# EAGLE design micro-board (EAGLE 9.6.2)
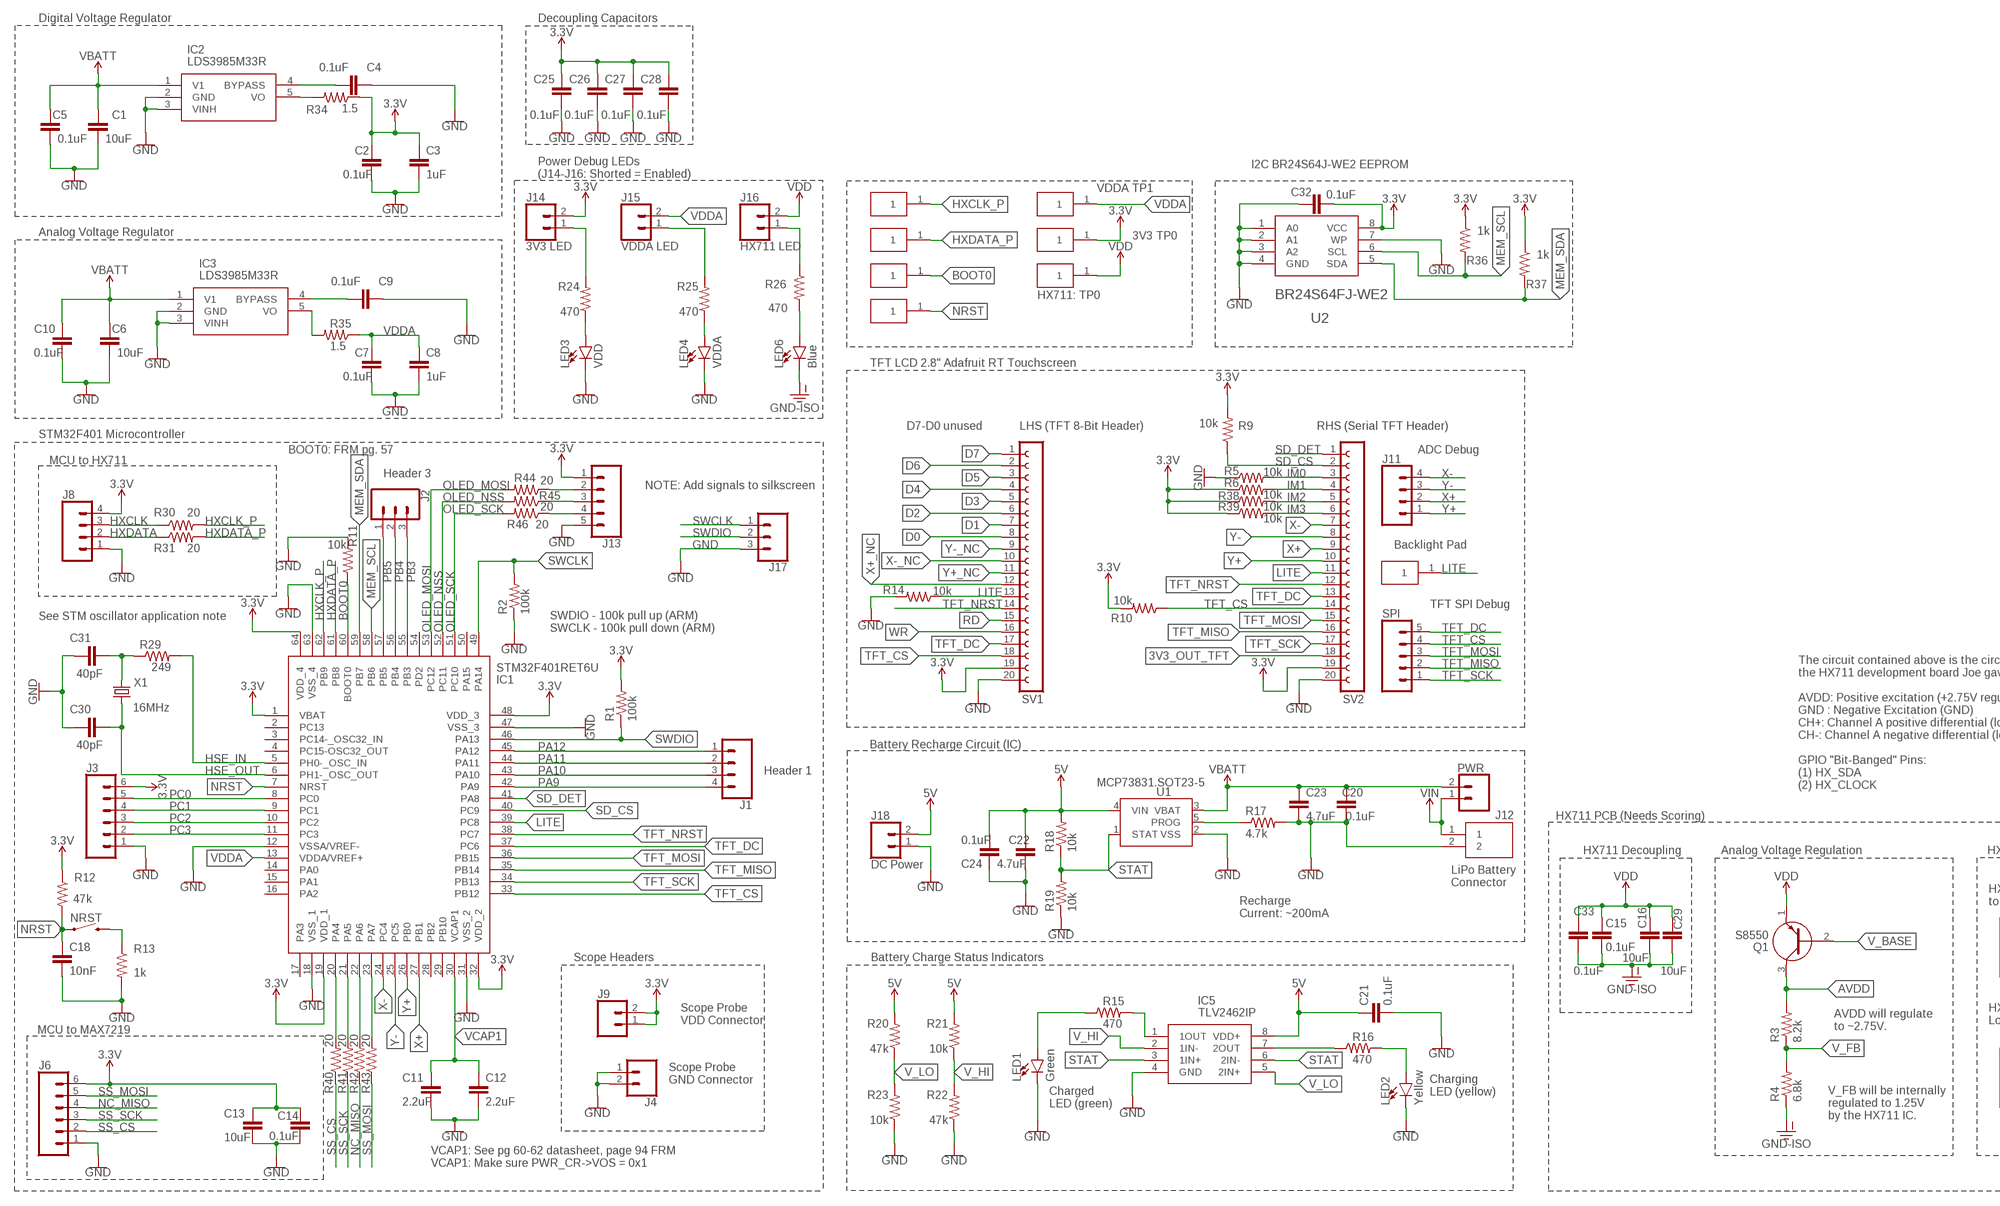
[diagram p0: schematic, sheet 1, part 1 of 2]
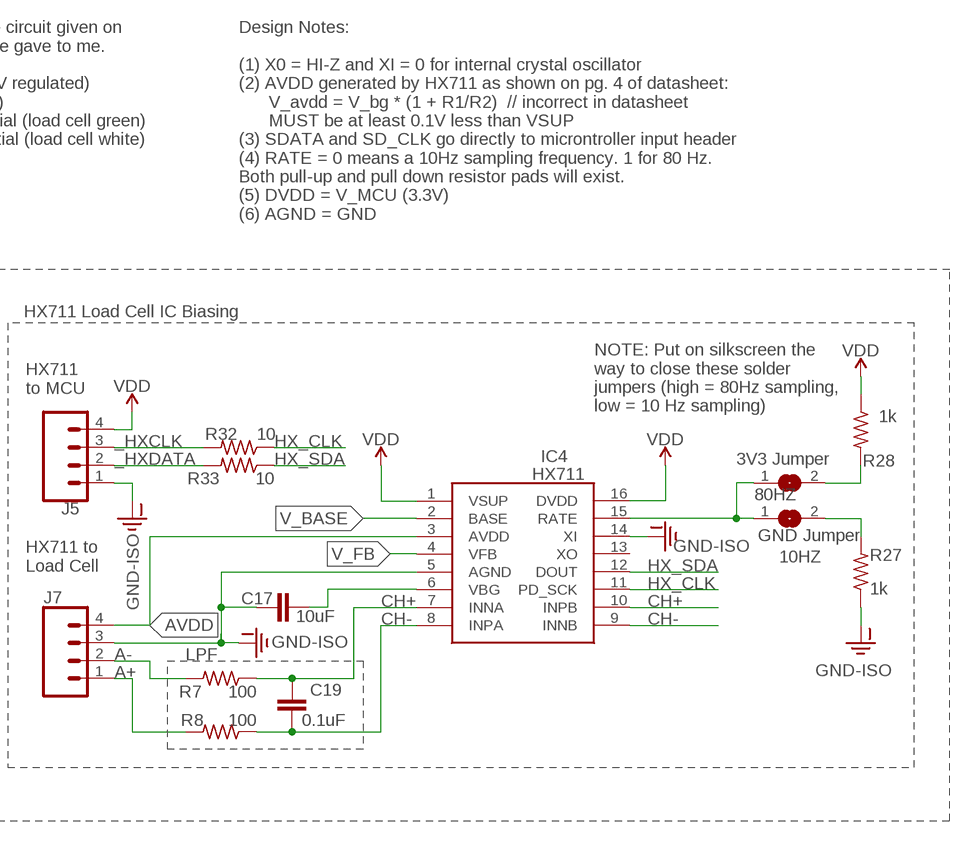
[diagram p1: schematic, sheet 1, part 2 of 2]

## Parts
10HZ  GND Jumper  SJ  [SJ]
80HZ  3V3 Jumper  SJ  [SJ]
C1  10uF  CAPACITOR0603  [C0603]
C2  0.1uF  CAPACITOR0603  [C0603]
C3  1uF  CAPACITOR0603  [C0603]
C4  0.1uF  CAPACITOR0603  [C0603]
C5  0.1uF  CAPACITOR0603  [C0603]
C6  10uF  CAPACITOR0603  [C0603]
C7  0.1uF  CAPACITOR0603  [C0603]
C8  1uF  CAPACITOR0603  [C0603]
C9  0.1uF  CAPACITOR0603  [C0603]
C10  0.1uF  CAPACITOR0603  [C0603]
C11  2.2uF  CAPACITOR0603  [C0603]
C12  2.2uF  CAPACITOR0603  [C0603]
C13  10uF  CAPACITOR0603  [C0603]
C14  0.1uF  CAPACITOR0603  [C0603]
C15  0.1uF  CAPACITOR0603  [C0603]
C16  10uF  CAPACITOR0603  [C0603]
C17  10uF  CAPACITOR0603  [C0603]
C18  10nF  CAPACITOR0603  [C0603]
C19  0.1uF  CAPACITOR0603  [C0603]
C20  0.1uF  CAPACITOR0603  [C0603]
C21  0.1uF  CAPACITOR0603  [C0603]
C22  4.7uF  C5/4.5  [C5B4.5]
C23  4.7uF  C5/4.5  [C5B4.5]
C24  0.1uF  CAPACITOR0603  [C0603]
C25  0.1uF  CAPACITOR0603  [C0603]
C26  0.1uF  CAPACITOR0603  [C0603]
C27  0.1uF  CAPACITOR0603  [C0603]
C28  0.1uF  CAPACITOR0603  [C0603]
C29  10uF  CAPACITOR0603  [C0603]
C30  40pF  CAPACITOR0603  [C0603]
C31  40pF  CAPACITOR0603  [C0603]
C32  0.1uF  CAPACITOR0603  [C0603]
C33  0.1uF  CAPACITOR0603  [C0603]
IC1  STM32F401RET6U  [QFP50P1200X1200X160-64N]
IC2  LDS3985M33R  [SOT95P280X145-5N]
IC3  LDS3985M33R  [SOT95P280X145-5N]
IC4  HX711  [SOIC127P600X160-16N]
IC5  TLV2462IP  [DIP794W53P254L959H508Q8N]
J1  CONN_04  [1X04]
J2  CONN_03  [1X03]
J3  CONN_06LOCK  [1X06_LOCK]
J4  CONN_02  [1X02]
J5  CONN_04  [1X04]
J6  CONN_06SILK_FEMALE_PTH  [1X06]
J7  CONN_04  [1X04]
J8  CONN_04  [1X04]
J9  CONN_02  [1X02]
J11  CONN_04  [1X04]
J12  B2B-PH-K-S_LF__SN_  [SHDR2W50P0X200_1X2_590X450X600]
J13  CONN_05  [1X05]
J14  3V3 LED  CONN_02  [1X02]
J15  VDDA LED  CONN_02  [1X02]
J16  HX711 LED  CONN_02  [1X02]
J17  CONN_03  [1X03]
J18  DC Power  CONN_02  [1X02]
LED1  Green  LED0603  [LED-0603]
LED2  Yellow  LED0603  [LED-0603]
LED3  VDD  LED0603  [LED-0603]
LED4  VDDA  LED0603  [LED-0603]
LED6  Blue  LED0603  [LED-0603]
NRST  MOMENTARY-SWITCH-SPST-SMD-5.2-REDUNDANT  [TACTILE_SWITCH_SMD_5.2MM]
PWR  CONN_02  [1X02]
Q1  S8550  [MJE13001TP]
R1  100k  RESISTOR0603  [R0603]
R2  100k  RESISTOR0603  [R0603]
R3  8.2k  RESISTOR0603  [R0603]
R4  6.8k  RESISTOR0603  [R0603]
R5  10k  RESISTOR0603  [R0603]
R6  10k  RESISTOR0603  [R0603]
R7  100  RESISTOR0603  [R0603]
R8  100  RESISTOR0603  [R0603]
R9  10k  RESISTOR0603  [R0603]
R10  10k  RESISTOR0603  [R0603]
R11  10k  RESISTOR0603  [R0603]
R12  47k  RESISTOR0603  [R0603]
R13  1k  RESISTOR0603  [R0603]
R14  10k  RESISTOR0603  [R0603]
R15  470  RESISTOR0603  [R0603]
R16  470  RESISTOR0603  [R0603]
R17  4.7k  RESISTOR0603  [R0603]
R18  10k  RESISTOR0603  [R0603]
R19  10k  RESISTOR0603  [R0603]
R20  47k  RESISTOR0603  [R0603]
R21  10k  RESISTOR0603  [R0603]
R22  47k  RESISTOR0603  [R0603]
R23  10k  RESISTOR0603  [R0603]
R24  470  RESISTOR0603  [R0603]
R25  470  RESISTOR0603  [R0603]
R26  470  RESISTOR0603  [R0603]
R27  1k  RESISTOR0603  [R0603]
R28  1k  RESISTOR0603  [R0603]
R29  249  RESISTOR0603  [R0603]
R30  20  RESISTOR0603  [R0603]
R31  20  RESISTOR0603  [R0603]
R32  10  RESISTOR0603  [R0603]
R33  10  RESISTOR0603  [R0603]
R34  1.5  RESISTOR0603  [R0603]
R35  1.5  RESISTOR0603  [R0603]
R36  1k  RESISTOR0603  [R0603]
R37  1k  RESISTOR0603  [R0603]
R38  10k  RESISTOR0603  [R0603]
R39  10k  RESISTOR0603  [R0603]
R40  20  RESISTOR0603  [R0603]
R41  20  RESISTOR0603  [R0603]
R42  20  RESISTOR0603  [R0603]
R43  20  RESISTOR0603  [R0603]
R44  20  RESISTOR0603  [R0603]
R45  20  RESISTOR0603  [R0603]
R46  20  RESISTOR0603  [R0603]
SPI  CONN_05  [1X05]
SV1  LHS (TFT 8-Bit Header)  FE20-1  [FE20]
SV2  RHS (Serial TFT Header)  FE20-1  [FE20]
U1  MCP73831.SOT23-5  [SOT23-5]
U2  BR24S64FJ-WE2  [SOIC8]
U$1  TP1  PAD  [PAD]
U$2  TP3  PAD  [PAD]
U$3  TP4  PAD  [PAD]
U$4  TP5  PAD  [PAD]
U$5  TP6  PAD  [PAD]
U$6  TP1  PAD  [PAD]
U$7  TP0  PAD  [PAD]
U$8  TP2  PAD  [PAD]
X1  16MHz  CRYSTALHC49S  [HC49/S]

## Nets
3.3V: C2.1 C3.1 C13.1 C14.1 C25.1 C26.1 C27.1 C28.1 C32.2 IC1.1(VBAT) IC1.19(VDD_1) IC1.32(VDD_2) IC1.48(VDD_3) IC1.64(VDD_4) J3.6 J6.6 J8.4 J9.1 J9.2 J13.1 J14.2 R1.2 R6.1 R9.2 R10.2 R12.1 R34.1 R36.1 R37.1 R38.1 R39.1 SV1.19 SV2.19 U2.8(VCC) U$7.1
3V3_LED: J14.1 R24.2
3V3_OUT_TFT: SV2.18
5V: C21.1 C22.1 C24.2 IC5.8(VDD+) J18.2 R18.2 R20.2 R21.2 U1.4(VIN)
_HXCLK: J5.3 R32.2
_HXDATA: J5.2 R33.2
_NC_MISO: IC1.22(PA6) R42.2
_SS_CS: IC1.20(PA4) R40.2
_SS_MOSI: IC1.23(PA7) R43.2
_SS_SCK: IC1.21(PA5) R41.2
A+: J7.1 R8.2
A-: J7.2 R7.2
ANA_LED: J15.1 R25.2
AVDD: IC4.3(AVDD) J7.4 Q1.3(C) R3.2
BOOT0: IC1.60(BOOT0) R11.1 U$4.1
CH+: C19.1 IC4.7(INNA) IC4.10(INPB) R7.1
CH-: C19.2 IC4.8(INPA) IC4.9(INNB) R8.1
D0: SV1.8
D1: SV1.7
D2: SV1.6
D3: SV1.5
D4: SV1.4
D5: SV1.3
D6: SV1.2
D7: SV1.1
GND: C1.2 C2.2 C3.2 C4.1 C5.2 C6.2 C7.2 C8.2 C9.1 C10.2 C11.2 C12.2 C13.2 C14.2 C18.2 C20.2 C21.2 C22.2 C23.2 C24.1 C25.2 C26.2 C27.2 C28.2 C30.1 C31.1 C32.1 IC1.12(VSSA/VREF-) IC1.18(VSS_1) IC1.31(VSS_2) IC1.47(VSS_3) IC1.63(VSS_4) IC2.2(GND) IC2.3(VINH) IC3.2(GND) IC3.3(VINH) IC5.4(GND) J3.1 J4.1 J4.2 J6.1 J8.1 J12.2 J13.5 J17.3 J18.1 LED1.C LED2.C LED3.C LED4.C R2.1 R5.1 R11.2 R13.2 R14.2 R17.2 R19.1 R22.1 R23.1 SV1.20 SV2.20 U1.2(VSS) U2.1(A0) U2.2(A1) U2.3(A2) U2.4(GND) U2.7(WP)
GND-ISO: C15.2 C16.2 C17.1 C29.2 C33.2 IC4.5(AGND) IC4.14(XI) J5.1 J7.3 LED6.C R4.1 R27.1
HSE_IN: IC1.5(PH0-_OSC_IN) R29.2
HSE_OUT: C30.2 IC1.6(PH1-_OSC_OUT) X1.1
HX_CLK: IC4.11(PD_SCK) R32.1
HX_LED: J16.1 R26.1
HX_SDA: IC4.12(DOUT) R33.1
HXCLK: J8.3 R30.1
HXCLK_P: IC1.62(PB9) R30.2 U$2.1
HXDATA: J8.2 R31.1
HXDATA_P: IC1.61(PB8) R31.2 U$3.1
IM0: R5.2 SV2.3
IM1: R6.2 SV2.4
IM2: R38.2 SV2.5
IM3: R39.2 SV2.6
LITE: IC1.39(PC8) R14.1 SV1.13 SV2.11 U$1.1
MEM_SCL: IC1.58(PB6) R36.2 U2.6(SCL)
MEM_SDA: IC1.59(PB7) R37.2 U2.5(SDA)
N$1: C9.2 IC3.4(BYPASS)
N$2: LED1.A R15.1
N$3: C4.2 IC2.4(BYPASS)
N$4: IC5.7(2OUT) R16.1
N$5: LED2.A R16.2
N$6: IC5.1(1OUT) R15.2
N$7: R17.1 U1.5(PROG)
N$8: J13.2 R44.1
N$9: LED4.A R25.1
N$10: 10HZ.2 R27.2
N$11: C17.2 IC4.6(VBG)
N$12: 10HZ.1 80HZ.1 IC4.15(RATE)
N$13: LED3.A R24.1
N$14: LED6.A R26.2
N$15: IC3.5(VO) R35.2
N$16: 80HZ.2 R28.2
N$17: NRST.3 NRST.4 R13.1
N$18: C31.2 R29.1 X1.2
N$19: IC2.5(VO) R34.2
N$20: J13.3 R45.1
N$21: J13.4 R46.1
NC_MISO: J6.4 R42.1
NRST: C18.1 IC1.7(NRST) NRST.1 NRST.2 R12.2 U$5.1
OLED_MOSI: IC1.53(PC12) R44.2
OLED_NSS: IC1.52(PC11) R45.2
OLED_SCK: IC1.51(PC10) R46.2
PA9: IC1.42(PA9) J1.4
PA10: IC1.43(PA10) J1.3
PA11: IC1.44(PA11) J1.2
PA12: IC1.45(PA12) J1.1
PB3: IC1.55(PB3) J2.3
PB4: IC1.56(PB4) J2.2
PB5: IC1.57(PB5) J2.1
PC0: IC1.8(PC0) J3.5
PC1: IC1.9(PC1) J3.4
PC2: IC1.10(PC2) J3.3
PC3: IC1.11(PC3) J3.2
RD: SV1.15
SD_CS: IC1.40(PC9) R9.1 SV2.2
SD_DET: IC1.41(PA8) SV2.1
SS_CS: J6.2 R40.1
SS_MOSI: J6.5 R43.1
SS_SCK: J6.3 R41.1
STAT: IC5.3(1IN+) IC5.6(2IN-) R18.1 R19.2 U1.1(STAT)
SWCLK: IC1.49(PA14) J17.1 R2.2
SWDIO: IC1.46(PA13) J17.2 R1.1
TFT_CS: IC1.33(PB12) R10.1 SPI.4 SV1.18 SV2.14
TFT_DC: IC1.37(PC6) SPI.5 SV1.17 SV2.13
TFT_MISO: IC1.35(PB14) SPI.2 SV2.16
TFT_MOSI: IC1.36(PB15) SPI.3 SV2.15
TFT_NRST: IC1.38(PC7) SV1.14 SV2.12
TFT_SCK: IC1.34(PB13) SPI.1 SV2.17
V_BASE: IC4.2(BASE) Q1.2(B)
V_BATT: C1.1 C5.1 C6.1 C10.1 C20.1 C23.1 IC2.1(V1) IC3.1(V1) PWR.2 U1.3(VBAT) ; supply symbol labelled VBATT
V_FB: IC4.4(VFB) R3.1 R4.2
V_HI: IC5.2(1IN-) R21.1 R22.2
V_LO: IC5.5(2IN+) R20.1 R23.2
VCAP1: C11.1 C12.1 IC1.30(VCAP1)
VDD: C15.1 C16.1 C29.1 C33.1 IC4.1(VSUP) IC4.16(DVDD) J5.4 J16.2 Q1.1(E) R28.1 U$8.1
VDDA: C7.1 C8.1 IC1.13(VDDA/VREF+) J15.2 R35.1 U$6.1
VIN: J12.1 PWR.1
WR: SV1.16
X+: IC1.27(PB1) J11.2 SV2.9
X+_NC: SV1.12
X-: IC1.24(PC4) J11.4 SV2.7
X-_NC: SV1.10
Y+: IC1.26(PB0) J11.1 SV2.10
Y+_NC: SV1.11
Y-: IC1.25(PC5) J11.3 SV2.8
Y-_NC: SV1.9
Unconnected: IC1.2(PC13) IC1.3(PC14-_OSC32_IN) IC1.4(PC15-OSC32_OUT) IC1.14(PA0) IC1.15(PA1) IC1.16(PA2) IC1.17(PA3) IC1.28(PB2) IC1.29(PB10) IC1.50(PA15) IC1.54(PD2) IC4.13(XO)

## Notes on the sheet
- Digital Voltage Regulator | Decoupling Capacitors
- I2C BR24S64J-WE2 EEPROM
- Power Debug LEDs
  (J14-J16: Shorted = Enabled)
- VDDA TP1
- Analog Voltage Regulator
- 3V3 TP0
- HX711: TP0
- TFT LCD 2.8" Adafruit RT Touchscreen
- D7-D0 unused
- STM32F401 Microcontroller
- BOOT0: FRM pg. 57 | ADC Debug
- MCU to HX711
- Header 3
- NOTE: Add signals to silkscreen
- Backlight Pad
- TFT SPI Debug
- See STM oscillator application note
- SWDIO - 100k pull up (ARM)
  SWCLK - 100k pull down (ARM)
- The circuit contained above is the circuit given on
  the HX711 development board Joe gave to me.
  
  AVDD: Positive excitation (+2.75V regulated)
  GND : Negative Excitation (GND)
  CH+: Channel A positive differential (load cell green)
  CH-: Channel A negative differential (load cell white)
  
  GPIO "Bit-Banged" Pins:
  (1) HX_SDA
  (2) HX_CLOCK
- Design Notes:
  
  (1) X0 = HI-Z and XI = 0 for internal crystal oscillator
  (2) AVDD generated by HX711 as shown on pg. 4 of datasheet:
        V_avdd = V_bg * (1 + R1/R2)  // incorrect in datasheet
        MUST be at least 0.1V less than VSUP
  (3) SDATA and SD_CLK go directly to microntroller input header
  (4) RATE = 0 means a 10Hz sampling frequency. 1 for 80 Hz.
  Both pull-up and pull down resistor pads will exist.
  (5) DVDD = V_MCU (3.3V)
  (6) AGND = GND
- Battery Recharge Circuit (IC)
- Header 1
- HX711 PCB (Needs Scoring)
- HX711 Decoupling | Analog Voltage Regulation | HX711 Load Cell IC Biasing
- LiPo Battery
  Connector
- HX711
  to MCU
- Recharge
  Current: ~200mA
- NOTE: Put on silkscreen the
  way to close these solder
  jumpers (high = 80Hz sampling,
  low = 10 Hz sampling)
- Scope Headers | Battery Charge Status Indicators
- Scope Probe
  VDD Connector
- HX711 to
  Load Cell
- AVDD will regulate 
  to ~2.75V.
- MCU to MAX7219
- Scope Probe
  GND Connector
- LPF
- Charging
  LED (yellow)
- Charged
  LED (green)
- V_FB will be internally
  regulated to 1.25V
  by the HX711 IC.
- VCAP1: See pg 60-62 datasheet, page 94 FRM
  VCAP1: Make sure PWR_CR->VOS = 0x1

## Library data of the parts
10HZ 80HZ = jumper:SJ: SMD solder JUMPER
C1-C21 C24-C33 = LinnesLab-Passives:CAPACITOR
C22 C23 = capacitor-wima:C: CAPACITOR naming: grid - package width
IC1 = SamacSys_Parts:STM32F401RET6U: STMICROELECTRONICS - STM32F401RET6U - MCU, 32BIT, CORTEX-M4, 84MHZ, LQFP-64 Source: Datasheet; DESCRIPTION: STMICROELECTRONICS - STM32F401RET6U - MCU, 32BIT, CORTEX-M4, 84MHZ, LQFP-64; HEIGHT: 1.6mm; MANUFACTURER_NAME: STMicroelectronics; MANUFACTURER_PART_NUMBER: STM32F401RET6U; MOUSER_PART_NUMBER: 511-STM32F401RET6U; MOUSER_PRICE-STOCK: https://www.mouser.co.uk/ProductDetail/STMicroelectronics/STM32F401RET6U?qs=9MuLHSklicoIHeb2rbkFrA%3D%3D
IC2 IC3 = SamacSys_Parts:LDS3985M33R: STMicroelectronics LDS3985M33R, Single Low Dropout Voltage Regulator, 300mA 3.3 V, 5-Pin SOT-23 Source: Datasheet; ARROW_PART_NUMBER: LDS3985M33R; ARROW_PRICE-STOCK: https://www.arrow.com/en/products/lds3985m33r/stmicroelectronics?region=nac; DESCRIPTION: STMicroelectronics LDS3985M33R, Single Low Dropout Voltage Regulator, 300mA 3.3 V, 5-Pin SOT-23; HEIGHT: 1.45mm; MANUFACTURER_NAME: STMicroelectronics; MANUFACTURER_PART_NUMBER: LDS3985M33R; MOUSER_PART_NUMBER: 511-LDS3985M33R; MOUSER_PRICE-STOCK: https://www.mouser.co.uk/ProductDetail/STMicroelectronics/LDS3985M33R?qs=DcAdhm6iCnom47SfkNYeVw%3D%3D
IC4 = SamacSys_Parts:HX711: 24-Bit Analog-to-Digital Converter (ADC) for Weigh Scale Source: Datasheet; DESCRIPTION: 24-Bit Analog-to-Digital Converter (ADC) for Weigh Scale; HEIGHT: 1.6mm; MANUFACTURER_NAME: AVIA Semiconductor; MANUFACTURER_PART_NUMBER: HX711
IC5 = SamacSys_Parts:TLV2462IP: Dual Low-Power, Rail-to-Rail Input/Output Operational Amplifier Source: Datasheet; ARROW_PART_NUMBER: TLV2462IP; ARROW_PRICE-STOCK: https://www.arrow.com/en/products/tlv2462ip/texas-instruments; DESCRIPTION: Dual Low-Power, Rail-to-Rail Input/Output Operational Amplifier; HEIGHT: 5.08mm; MANUFACTURER_NAME: Texas Instruments; MANUFACTURER_PART_NUMBER: TLV2462IP; MOUSER_PART_NUMBER: 595-TLV2462IP; MOUSER_PRICE-STOCK: https://www.mouser.co.uk/ProductDetail/Texas-Instruments/TLV2462IP?qs=0le1rQK8zxo1BiHyPl8Tnw%3D%3D
J1 J5 J7 J8 J11 = LinnesLab-Connectors:CONN_04: Multi connection point. Often used as Generic Header-pin footprint for 0.1 inch spaced/style header connections On any of the 0.1 inch spaced packages, you can populate with these: Break Away Headers - Straight (PRT-00116) Break Away Male Headers - Right Angle (PRT-00553) Female Headers (PRT-00115) Break Away Headers - Machine Pin (PRT-00117) Break Away Female Headers - Swiss Machine Pin (PRT-00743) For SCREWTERMINALS and SPRING TERMINALS visit here: Screw Terimnals on SparkFun.com (5mm/3.5mm/2.54mm spacing) This device is also useful as a general connection point to wire up your design to another part of your project. Our various solder wires solder well into these plated through hole pads. Hook-Up Wire - Assortment (Stranded, 22 AWG) (PRT-11375) Hook-Up Wire - Assortment (Solid Core, 22 AWG) (PRT-11367) View the entire wire category on our website here Special notes: Molex polarized connector foot print use with SKU : PRT-08231 with associated crimp pins and housings. 1MM SMD Version SKU: PRT-10208; PROD_ID: CONN-09696
J2 J17 = LinnesLab-Connectors:CONN_03: Multi connection point. Often used as Generic Header-pin footprint for 0.1 inch spaced/style header connections On any of the 0.1 inch spaced packages, you can populate with these: Break Away Headers - Straight (PRT-00116) Break Away Male Headers - Right Angle (PRT-00553) Female Headers (PRT-00115) Break Away Headers - Machine Pin (PRT-00117) Break Away Female Headers - Swiss Machine Pin (PRT-00743) Stackable Header - 3 Pin (Female, 0.1") (PRT-13875) For SCREWTERMINALS and SPRING TERMINALS visit here: Screw Terimnals on SparkFun.com (5mm/3.5mm/2.54mm spacing) This device is also useful as a general connection point to wire up your design to another part of your project. Our various solder wires solder well into these plated through hole pads. Hook-Up Wire - Assortment (Stranded, 22 AWG) (PRT-11375) Hook-Up Wire - Assortment (Solid Core, 22 AWG) (PRT-11367) View the entire wire category on our website here Special notes: Molex polarized connector foot print use with SKU : PRT-08232 with associated crimp pins and housings.
J3 = LinnesLab-Connectors:CONN_06: Multi connection point. Often used as Generic Header-pin footprint for 0.1 inch spaced/style header connections On any of the 0.1 inch spaced packages, you can populate with these: Break Away Headers - Straight (PRT-00116) Break Away Male Headers - Right Angle (PRT-00553) Female Headers (PRT-00115) Break Away Headers - Machine Pin (PRT-00117) Break Away Female Headers - Swiss Machine Pin (PRT-00743) Arduino Stackable Header - 6 Pin (PRT-09280) For SCREWTERMINALS and SPRING TERMINALS visit here: Screw Terimnals on SparkFun.com (5mm/3.5mm/2.54mm spacing) This device is also useful as a general connection point to wire up your design to another part of your project. Our various solder wires solder well into these plated through hole pads. Hook-Up Wire - Assortment (Stranded, 22 AWG) (PRT-11375) Hook-Up Wire - Assortment (Solid Core, 22 AWG) (PRT-11367) View the entire wire category on our website here
J4 J9 J14-J16 J18 PWR = LinnesLab-Connectors:CONN_02: Multi connection point. Often used as Generic Header-pin footprint for 0.1 inch spaced/style header connections On any of the 0.1 inch spaced packages, you can populate with these: Break Away Headers - Straight (PRT-00116) Break Away Male Headers - Right Angle (PRT-00553) Female Headers (PRT-00115) Break Away Headers - Machine Pin (PRT-00117) Break Away Female Headers - Swiss Machine Pin (PRT-00743) For SCREWTERMINALS and SPRING TERMINALS visit here: Screw Terimnals on SparkFun.com (5mm/3.5mm/2.54mm spacing) This device is also useful as a general connection point to wire up your design to another part of your project. Our various solder wires solder well into these plated through hole pads. Hook-Up Wire - Assortment (Stranded, 22 AWG) (PRT-11375) Hook-Up Wire - Assortment (Solid Core, 22 AWG) (PRT-11367) View the entire wire category on our website here Special notes: Molex polarized connector foot print use with: PRT-08233 with associated crimp pins and housings. 2.54_SCREWTERM for use with PRT-10571. 3.5mm Screw Terminal footprints for PRT-08084 5mm Screw Terminal footprints for use with PRT-08432
J6 = LinnesLab-Connectors:CONN_06: Multi connection point. Often used as Generic Header-pin footprint for 0.1 inch spaced/style header connections On any of the 0.1 inch spaced packages, you can populate with these: Break Away Headers - Straight (PRT-00116) Break Away Male Headers - Right Angle (PRT-00553) Female Headers (PRT-00115) Break Away Headers - Machine Pin (PRT-00117) Break Away Female Headers - Swiss Machine Pin (PRT-00743) Arduino Stackable Header - 6 Pin (PRT-09280) For SCREWTERMINALS and SPRING TERMINALS visit here: Screw Terimnals on SparkFun.com (5mm/3.5mm/2.54mm spacing) This device is also useful as a general connection point to wire up your design to another part of your project. Our various solder wires solder well into these plated through hole pads. Hook-Up Wire - Assortment (Stranded, 22 AWG) (PRT-11375) Hook-Up Wire - Assortment (Solid Core, 22 AWG) (PRT-11367) View the entire wire category on our website here; PROD_ID: CONN-08437
J12 = SamacSys_Parts:B2B-PH-K-S_LF__SN_: Conn Shrouded Header HDR 2 POS 2mm Solder ST Thru-Hole Box Source: Datasheet; ARROW_PART_NUMBER: B2B-PH-K-S(LF)(SN); ARROW_PRICE-STOCK: https://www.arrow.com/en/products/b2b-ph-k-s-lf-sn/jst-manufacturing; DESCRIPTION: Conn Shrouded Header HDR 2 POS 2mm Solder ST Thru-Hole Box; HEIGHT: 6mm; MANUFACTURER_NAME: JST (JAPAN SOLDERLESS TERMINALS); MANUFACTURER_PART_NUMBER: B2B-PH-K-S(LF)(SN)
J13 SPI = LinnesLab-Connectors:CONN_05: Multi connection point. Often used as Generic Header-pin footprint for 0.1 inch spaced/style header connections On any of the 0.1 inch spaced packages, you can populate with these: Break Away Headers - Straight (PRT-00116) Break Away Male Headers - Right Angle (PRT-00553) Female Headers (PRT-00115) Break Away Headers - Machine Pin (PRT-00117) Break Away Female Headers - Swiss Machine Pin (PRT-00743) For SCREWTERMINALS and SPRING TERMINALS visit here: Screw Terimnals on SparkFun.com (5mm/3.5mm/2.54mm spacing) This device is also useful as a general connection point to wire up your design to another part of your project. Our various solder wires solder well into these plated through hole pads. Hook-Up Wire - Assortment (Stranded, 22 AWG) (PRT-11375) Hook-Up Wire - Assortment (Solid Core, 22 AWG) (PRT-11367) View the entire wire category on our website here Special notes: Molex polarized connector foot print use with SKU : PRT-08231 with associated crimp pins and housings. 1MM SMD Version SKU: PRT-10208
LED1-LED4 LED6 = LinnesLab-LED:LED: LED (Generic) Standard schematic elements and footprints for 5mm, 3mm, 1206, and 0603 sized LEDs. Generic LEDs with no color specified. LTST-C190KGKT: arrow indicates cathode
NRST = SparkFun-Switches:MOMENTARY-SWITCH-SPST: Momentary Switch (Pushbutton) - SPST Normally-open (NO) SPST momentary switches (buttons, pushbuttons). Variants PTH-12MM - 12mm square, through-hole Momentary Pushbutton Switch - 12mm Square (COM-09190) PTH-6.0MM, PTH-6.0MM-KIT - 6.0mm square, through-hole Mini Pushbutton Switch (COM-00097) KIT package intended for soldering kit's - only one side of pads' copper is exposed. PTH-RIGHT-ANGLE-KIT - Right-angle, through-hole Right Angle Tactile Button - Used on SparkFun BigTime Watch Kit SMD-12MM - 12mm square, surface-mount Tactile Button - SMD (12mm) (COM-12993) Used on SparkFun PicoBoard SMD-4.5MM - 4.5mm Square Trackball Switch Used on SparkFun Blackberry Trackballer Breakout SMD-4.6MMX2.8MM - 4.60mm x 2.80mm, surface mount Used on SparkFun SAMD21 Mini Breakout SMD-5.2MM, SMD-5.2-REDUNDANT - 5.2mm square, surface-mount Mini Pushbutton Switch - SMD (COM-08720) Used on Arduino Pro Mini REDUNDANT package connects both switch circuits together SMD-6.0X3.5MM - 6.0 x 3.5mm, surface mount Momentary Reset Switch SMD (COM-08229) SMD-6.2MM-TALL - 6.2mm square, surface mount Tactile Button - SMD (6mm) Used on SparkFun Digital Sandbox SMD-RIGHT-ANGLE - Right-angle, surface mount Used on SparkFun Block for Intel® Edison - Arduino; PROD_ID: SWCH-08247; SF_SKU: COM-08720
Q1 = SamacSys_Parts:S8550: PNP Silicon Transistors Source: Datasheet; DESCRIPTION: PNP Silicon Transistors; HEIGHT: mm; MANUFACTURER_NAME: MCC(Micro Commercial Components); MANUFACTURER_PART_NUMBER: S8550
R1-R46 = LinnesLab-Passives:RESISTOR
SV1 SV2 = con-lsta:FE20-1: FEMALE HEADER; OC_FARNELL: unknown; OC_NEWARK: unknown
U1 = LinnesLab-Power:MCP73831
U2 = I2C-EEPROM:BR24S64FJ-WE2: 64Kbit size EEPROM using the I2C protocol for communication
U$1-U$8 = LinnesLab-Connectors:PAD
X1 = crystal:CRYSTAL: CRYSTAL; OC_FARNELL: 1667008; OC_NEWARK: unknown

## Board
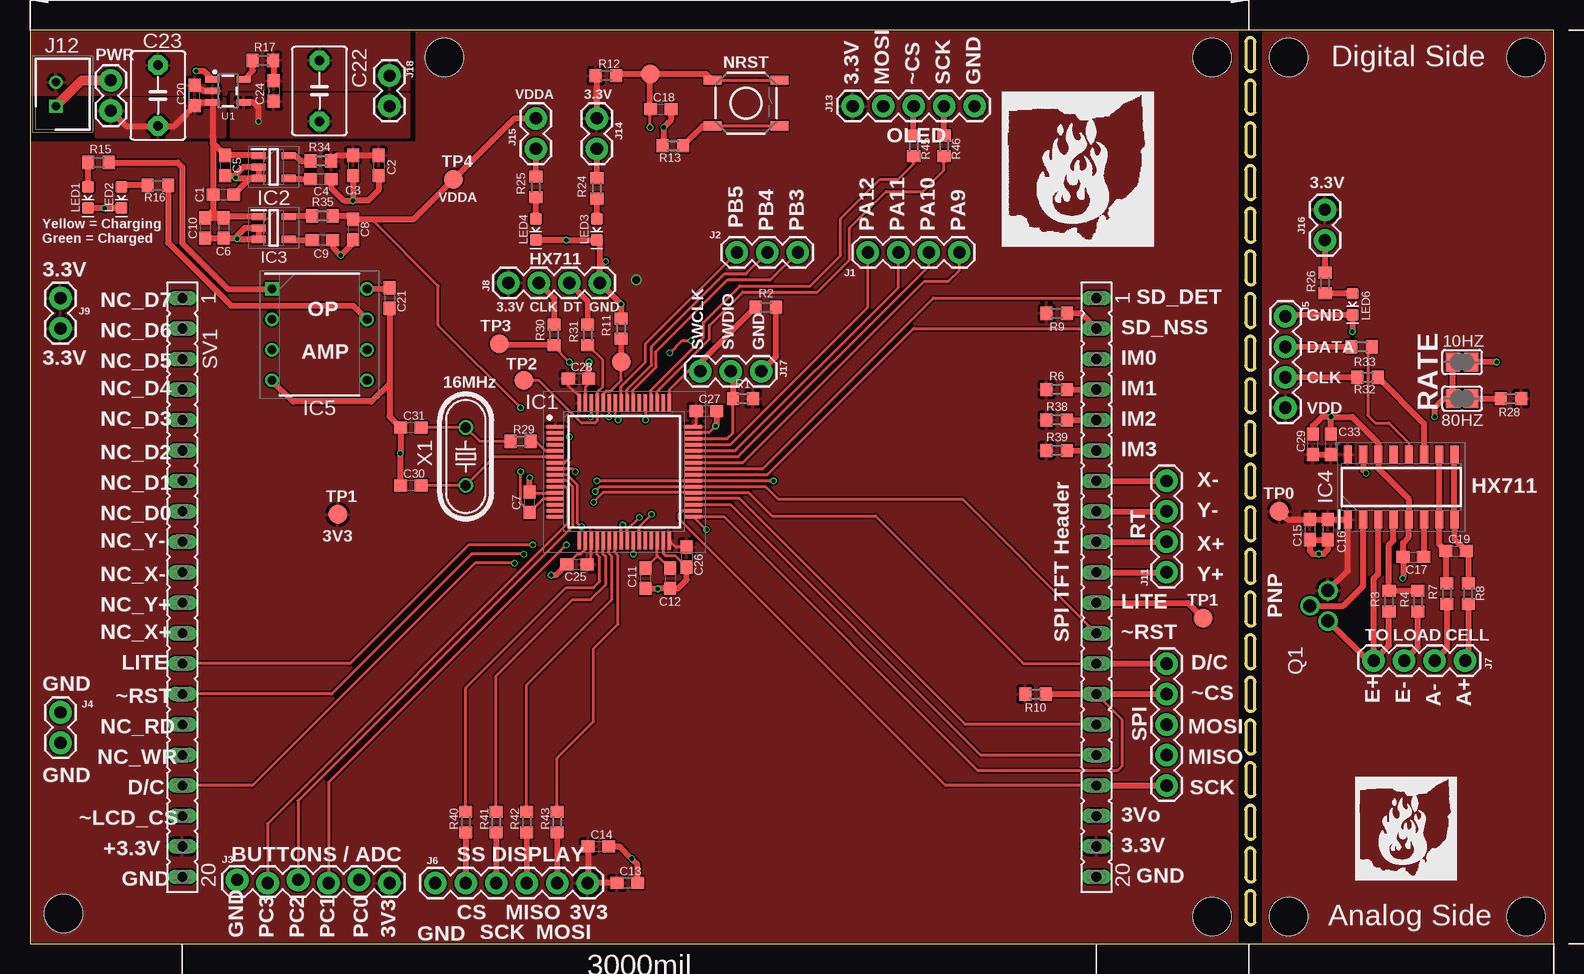
[diagram p2: board, top side]
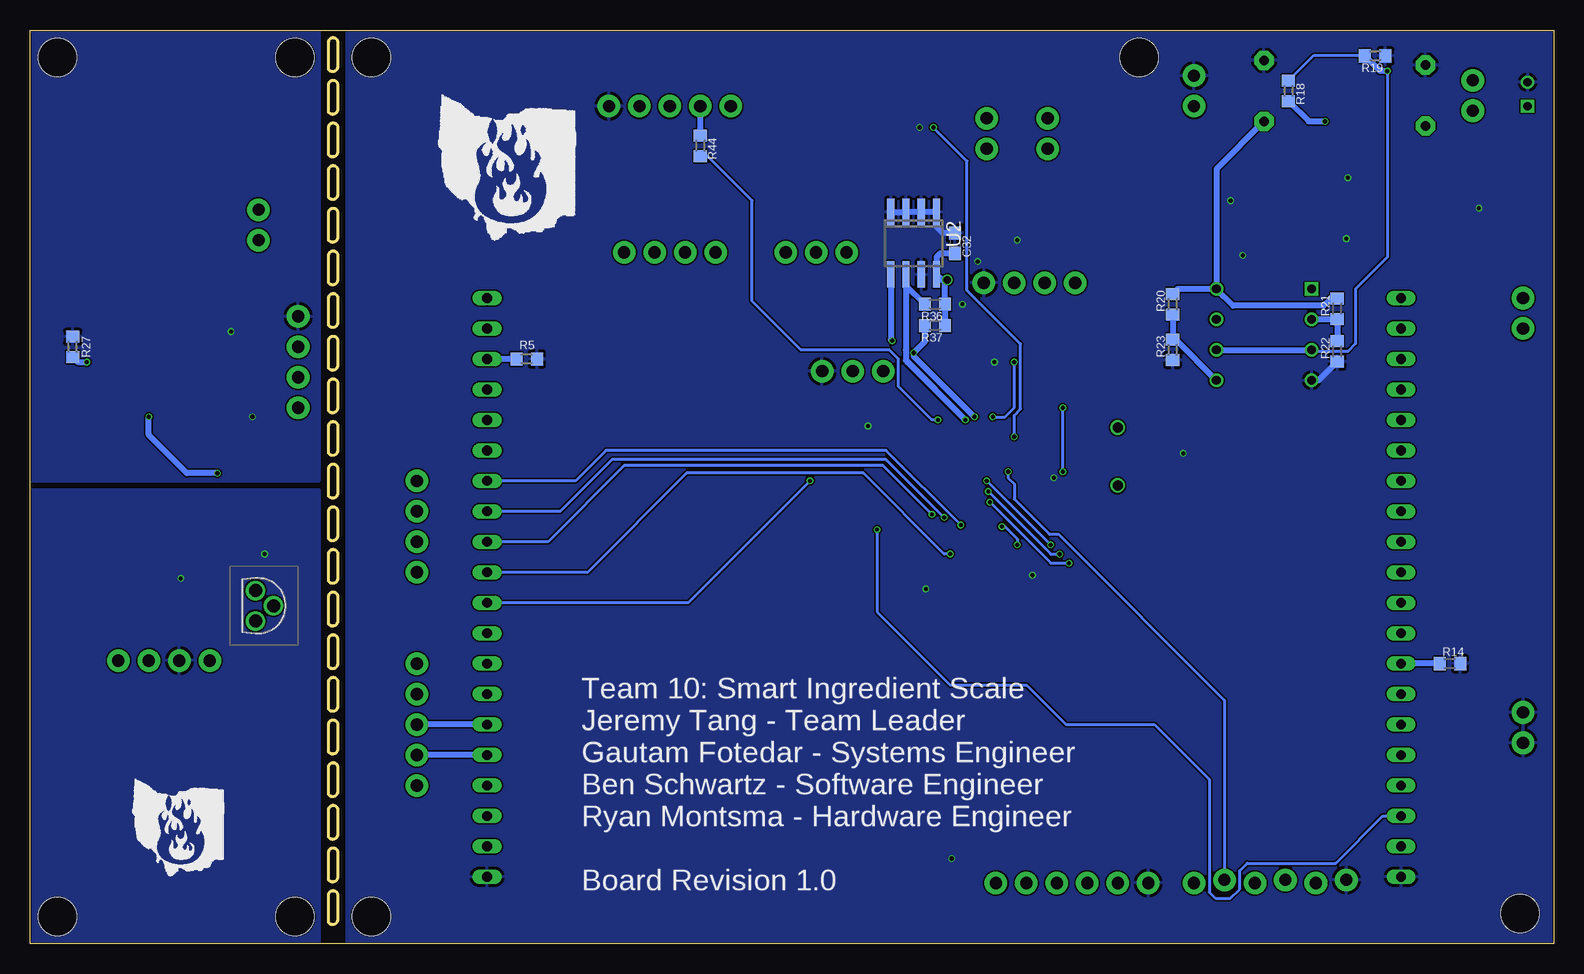
[diagram p3: board, bottom side, seen from below]

Size 127 x 76.2 mm. Coordinates in mm from the lower left corner, seen from the top.
Outline: 88 segments
Copper layers (1*16): Top 0.035mm / dielectric 0.2mm / Bottom 0.035mm
Design rules "jlcpcb *": minimum track width 8mil, minimum drill 0.2mm, track to track 5mil, track to pad 5mil, pad to pad 5mil, via to via 5mil, smd to smd 0mil, copper to edge 0.1mm, drill to drill 5mil, minimum pad ring 4mil, minimum via ring 4mil, stop-mask expansion 3mil, vias tented up to drill 100mil, thermal gap 10mil
Holes 3.2 mm at 98.55,73.91 98.55,2.29 2.79,2.54 34.54,73.91 104.9,73.91 124.71,73.91 124.71,2.29 104.9,2.29

### Footprints (pad centres in the part's own frame; a part is rotated, then mirrored left to right if it is on the bottom)
SJ = smd 1.168 x 1.6: 1 -0.762,0; 2 0.762,0
C0603 = smd 1.1 x 1: 1 -0.85,0; 2 0.85,0
C5B4.5 = drill 0.813 pad 1.6 octagon: 1 -2.54,0; 2 2.54,0
QFP50P1200X1200X160-64N = smd 1.475 x 0.3: 1 -5.738,3.75; 2 -5.738,3.25; 3 -5.738,2.75; 4 -5.738,2.25; 5 -5.738,1.75; 6 -5.738,1.25; 7 -5.738,0.75; 8 -5.738,0.25; 9 -5.738,-0.25; 10 -5.738,-0.75; 11 -5.738,-1.25; 12 -5.738,-1.75; 13 -5.738,-2.25; 14 -5.738,-2.75; 15 -5.738,-3.25; 16 -5.738,-3.75; 33 5.738,-3.75; 34 5.738,-3.25; 35 5.738,-2.75; 36 5.738,-2.25; 37 5.738,-1.75; 38 5.738,-1.25; 39 5.738,-0.75; 40 5.738,-0.25; 41 5.738,0.25; 42 5.738,0.75; 43 5.738,1.25; 44 5.738,1.75; 45 5.738,2.25; 46 5.738,2.75; 47 5.738,3.25; 48 5.738,3.75 | smd 0.3 x 1.475: 17 -3.75,-5.738; 18 -3.25,-5.738; 19 -2.75,-5.738; 20 -2.25,-5.738; 21 -1.75,-5.738; 22 -1.25,-5.738; 23 -0.75,-5.738; 24 -0.25,-5.738; 25 0.25,-5.738; 26 0.75,-5.738; 27 1.25,-5.738; 28 1.75,-5.738; 29 2.25,-5.738; 30 2.75,-5.738; 31 3.25,-5.738; 32 3.75,-5.738; 49 3.75,5.738; 50 3.25,5.738; 51 2.75,5.738; 52 2.25,5.738; 53 1.75,5.738; 54 1.25,5.738; 55 0.75,5.738; 56 0.25,5.738; 57 -0.25,5.738; 58 -0.75,5.738; 59 -1.25,5.738; 60 -1.75,5.738; 61 -2.25,5.738; 62 -2.75,5.738; 63 -3.25,5.738; 64 -3.75,5.738
SOT95P280X145-5N = smd 1.15 x 0.6: 1 -1.25,0.95; 2 -1.25,0; 3 -1.25,-0.95; 4 1.25,-0.95; 5 1.25,0.95
SOIC127P600X160-16N = smd 1.525 x 0.7: 1 -2.712,4.445; 2 -2.712,3.175; 3 -2.712,1.905; 4 -2.712,0.635; 5 -2.712,-0.635; 6 -2.712,-1.905; 7 -2.712,-3.175; 8 -2.712,-4.445; 9 2.712,-4.445; 10 2.712,-3.175; 11 2.712,-1.905; 12 2.712,-0.635; 13 2.712,0.635; 14 2.712,1.905; 15 2.712,3.175; 16 2.712,4.445
DIP794W53P254L959H508Q8N = drill 0.73 pad 1.13 square: 1 -3.97,3.81 | drill 0.73 pad 1.13: 2 -3.97,1.27; 3 -3.97,-1.27; 4 -3.97,-3.81; 5 3.97,-3.81; 6 3.97,-1.27; 7 3.97,1.27; 8 3.97,3.81
1X04 = drill 1.016 pad 1.88: 1 0,0; 2 2.54,0; 3 5.08,0; 4 7.62,0
1X03 = drill 1.016 pad 1.88: 1 0,0; 2 2.54,0; 3 5.08,0
1X06_LOCK = drill 1.016 pad 1.88: 1 0,0; 2 2.54,-0.254; 3 5.08,0; 4 7.62,-0.254; 5 10.16,0; 6 12.7,-0.254
1X02 = drill 1.016 pad 1.88: 1 0,0; 2 2.54,0
1X06 = drill 1.016 pad 1.88: 1 0,0; 2 2.54,0; 3 5.08,0; 4 7.62,0; 5 10.16,0; 6 12.7,0
SHDR2W50P0X200_1X2_590X450X600 = drill 0.7 pad 1.1 square: 1 0,0 | drill 0.7 pad 1.1: 2 -2,0
1X05 = drill 1.016 pad 1.88: 1 0,0; 2 2.54,0; 3 5.08,0; 4 7.62,0; 5 10.16,0
LED-0603 = smd 1 x 1: A -0.877,0; C 0.877,0
TACTILE_SWITCH_SMD_5.2MM = smd 1.524 x 0.762: 1 -2.794,1.905; 2 2.794,1.905; 3 -2.794,-1.905; 4 2.794,-1.905
MJE13001TP = drill 1.09 pad 1.6: 1 0,0; 2 1.27,1.5; 3 2.54,0
R0603 = smd 1 x 1.1: 1 -0.85,0; 2 0.85,0
FE20 = drill 0.813 long: 1 -24.13,0; 2 -21.59,0; 3 -19.05,0; 4 -16.51,0; 5 -13.97,0; 6 -11.43,0; 7 -8.89,0; 8 -6.35,0; 9 -3.81,0; 10 -1.27,0; 11 1.27,0; 12 3.81,0; 13 6.35,0; 14 8.89,0; 15 11.43,0; 16 13.97,0; 17 16.51,0; 18 19.05,0; 19 21.59,0; 20 24.13,0
SOT23-5 = smd 0.55 x 1.2: 1 -0.95,-1.3; 2 0,-1.3; 3 0.95,-1.3; 4 0.95,1.3; 5 -0.95,1.3
SOIC8 = smd 0.6 x 2.2: 1 -1.905,-2.6; 2 -0.635,-2.6; 3 0.635,-2.6; 4 1.905,-2.6; 5 1.905,2.6; 6 0.635,2.6; 7 -0.635,2.6; 8 -1.905,2.6
PAD = smd 1.6 x 1.6: 1 0,0
HC49/S = drill 0.813: 1 -2.413,0; 2 2.413,0

### Placement (x,y rotation side)
10HZ  119.38,48.51 0 top
80HZ  119.38,45.47 0 top
C1  16.13,62.48 0 top
C2  29.08,64.9 270 top
C3  26.92,64.9 270 top
C4  24.26,63.75 180 top
C5  16.26,64.9 270 top
C6  16.13,59.69 270 top
C7  41.66,36.83 90 top
C8  26.92,59.56 270 top
C9  24.38,58.67 180 top
C10  14.61,59.69 270 top
C11  51.31,30.48 270 top
C12  53.34,30.48 270 top
C13  49.78,5.08 0 top
C14  47.37,8.13 0 top
C15  106.68,34.54 270 top
C16  108.2,34.54 270 top
C17  115.32,32.26 0 top
C18  52.58,69.6 0 top
C19  118.87,32.77 0 top
C20  13.72,70.74 90 top
C21  29.97,53.85 270 top
C22  24.13,71.12 90 top
C23  10.67,70.74 90 top
C24  20.32,71.12 270 top
C25  45.59,31.62 180 top
C26  54.74,32.26 270 top
C27  56.39,44.45 0 top
C28  45.72,47.12 0 top
C29  106.93,41.66 90 top
C30  31.75,38.23 0 top
C31  31.75,43.05 0 top
C32  49.91,58.42 270 bottom
C33  108.46,41.66 90 top
IC1  49.53,39.37 0 top
IC2  20.32,64.77 0 top
IC3  20.32,59.69 0 top
IC4  114.3,38.1 90 top
IC5  24.13,50.8 0 top
J1  69.85,57.66 0 top
J2  58.93,57.66 0 top
J3  17.27,5.33 0 top
J4  2.54,19.3 270 top
J5  104.65,52.32 270 top
J6  33.78,5.08 0 top
J7  119.63,23.62 180 top
J8  47.5,55.12 180 top
J9  2.54,53.85 270 top
J11  94.74,30.99 90 top
J12  2.16,69.85 270 top
J13  68.58,69.85 0 top
J14  47.24,66.29 90 top
J15  42.16,66.29 90 top
J16  107.95,58.67 90 top
J17  55.88,47.75 0 top
J18  29.97,72.39 270 top
LED1  4.83,62.23 270 top
LED2  7.62,62.23 270 top
LED3  47.24,59.56 270 top
LED4  42.16,59.56 270 top
LED6  110.24,53.34 270 top
NRST  59.69,70.1 0 top
PWR  6.73,72.01 270 top
Q1  108.2,29.46 270 bottom
R1  59.44,45.47 0 top
R2  61.34,53.09 180 top
R3  113.28,28.57 270 top
R4  115.7,28.57 90 top
R5  85.6,48.77 180 bottom
R6  85.6,46.23 0 top
R7  118.11,29.21 270 top
R8  119.89,29.21 270 top
R9  85.6,52.58 180 top
R10  83.82,20.83 180 top
R11  49.28,51.31 90 top
R12  48.01,72.39 0 top
R13  53.59,66.55 180 top
R14  8.64,23.37 0 bottom
R15  5.71,65.15 0 top
R16  10.67,63.25 180 top
R17  19.43,73.66 0 top
R18  22.1,71.12 270 bottom
R19  14.86,74.04 180 bottom
R20  31.75,53.34 90 bottom
R21  18.03,52.96 90 bottom
R22  18.03,49.4 90 bottom
R23  31.75,49.53 90 bottom
R24  47.24,62.99 90 top
R25  42.16,63.12 90 top
R26  107.95,55.12 270 top
R27  123.44,49.78 270 bottom
R28  123.44,45.47 180 top
R29  40.89,41.91 0 top
R30  43.69,50.8 270 top
R31  46.48,50.8 270 top
R32  111.51,47.24 180 top
R33  111,49.78 180 top
R34  24.26,65.28 180 top
R35  24.38,60.71 180 top
R36  51.56,53.34 180 bottom
R37  51.56,51.56 180 bottom
R38  85.6,43.69 0 top
R39  85.6,41.15 0 top
R40  36.32,10.16 90 top
R41  38.86,10.16 90 top
R42  41.4,10.16 90 top
R43  43.94,10.16 90 top
R44  71.12,66.55 270 bottom
R45  73.66,66.55 270 top
R46  76.2,66.55 270 top
SPI  94.74,13.21 90 top
SV1  12.7,29.72 270 top
SV2  88.9,29.72 270 top
U1  16.51,71.12 270 top
U2  53.34,58.42 180 bottom
U$1  97.79,27.18 0 top
U$2  39.12,50.04 0 top
U$3  41.15,46.99 0 top
U$4  49.28,48.51 0 top
U$5  51.69,72.52 0 top
U$6  35.31,63.75 0 top
U$7  25.65,35.81 0 top
U$8  104.14,36.07 0 top
U$9  [BURNING-OHIO]  81.03,58.17 0 top
U$10  [BURNING-OHIO2]  110.49,5.33 0 top
X1  36.32,40.64 90 top

### Tracks (layer width: path | path; a pad name or v marks a point on that pad's centre or on a via)
3.3V  (via drill 0.6)
  Top 0.254: C28.1 44.87,46.57 45.78,45.66 IC1.64 | C25.1 46.78,31.96 IC1.19 | C26.1 53.8,33.11 IC1.32 | C27.1 55.54,43.39 IC1.48
  Top 0.508: R34.1 25.58,65.75 C3.1 C2.1 | R12.1 47.24,72.3 J14.2 | C14.1 46.52,5.12 | 46.52,5.12 J6.6 | C13.1 46.56,5.08 46.52,5.12
  Bottom 0.508: R37.1 R36.1 50.71,55.21 v50.55,55.37 50.99,55.37 U2.8 51.44,57.28 51.14,57.57 C32.2
  pour Top: 0,0 0,66.8 32.26,66.8 32.26,76.07 100.58,76.07 100.58,0
3V3_LED
  Top 0.508: J14.1 R24.2
5V  (via drill 0.35)
  Top 0.508: v19.05,68.58 19.05,69.72 18.6,70.17 U1.4 | C21.1 29.88,54.61 IC5.8
  Bottom 0.508: R21.2 18.58,53.81 19.18,53.21 26.7,53.21 IC5.8 | R18.2 20.41,68.58 v19.05,68.58 | C22.1 28.1,64.61 IC5.8 | IC5.8 31.33,54.61 R20.2
  pour Top: 16.76,70.87 16.76,67.31 31.62,67.31 31.62,70.87
_HXCLK
  Top 0.508: J5.3 R32.2
_HXDATA
  Top 0.508: J5.2 R33.2
_NC_MISO
  Top 0.254: R42.2 41.4,21.59 48.51,28.7 48.51,32.32 48.28,32.55 IC1.22
_SS_CS
  Top 0.254: R40.2 36.32,21.34 44.7,29.72 46.99,29.72 47.5,30.23 47.5,32.26 47.28,32.48 IC1.20
_SS_MOSI
  Top 0.254: R43.2 43.94,15.49 46.99,18.54 46.99,24.64 49.02,26.67 49.02,32.38 48.78,32.63 IC1.23
_SS_SCK
  Top 0.254: R41.2 38.86,22.35 45.21,28.7 46.74,28.7 48.01,29.97 48.01,32.29 47.77,32.53 47.77,33.62 IC1.21
A+
  Top 0.508: R8.2 119.89,23.88 J7.1
A-
  Top 0.508: R7.2 118.11,24.64 J7.2
ANA_LED
  Top 0.508: J15.1 R25.2
AVDD
  Top 0.508: J7.4 112.01,30.48 112.39,30.86 IC4.3 | Q1.3 111.51,23.62 J7.4 | J7.4 113.28,24.89 R3.2
BOOT0
  Top 0.254: IC1.60 47.78,45.85 48.02,46.1 48.39,46.1 49.28,46.99 U$4.1
  Top 0.508: R11.1 U$4.1
CH+
  Top 0.508: R7.1 118.02,30.15 C19.1 117.47,33.31 IC4.7 IC4.10
CH-
  Top 0.508: R8.1 119.89,32.6 C19.2 118.75,33.74 IC4.8 IC4.9
GND  (via drill 0.35)
  Top 0.254: IC1.12 43.76,37.59 41.74,37.59 C7.2 | C28.2 46.57,46.7 46.28,46.41 IC1.63 | C25.2 45.63,32.51 45.91,32.51 46.28,32.88 IC1.18 | IC1.31 52.78,32.56 52.96,32.38 53.76,32.38 C26.2 | v57.15,43.18 56.59,42.62 IC1.47
  Top 0.508: IC2.3 IC2.2 17.78,64.77 17.14,64.14 v17.14,63.88 | IC2.3 17.21,63.82 v17.14,63.88 | v17.27,58.8 17.27,59.05 17.91,59.69 IC3.2 IC3.3 17.33,58.74 v17.27,58.8 | R17.2 20.32,73.62 C24.1 | C5.2 16.98,64.05 v17.14,63.88 | C10.2 C6.2 17.23,58.84 v17.27,58.8 | C1.2 18.32,63.82 IC2.3 | 30.9,40.93 C31.1 29.97,43.98 29.97,46.74 | 30.9,40.93 v30.86,40.89 | C30.1 30.9,40.93 | C9.1 25.27,58.63 25.27,58.04 v25.91,57.4 26.92,58.42 C8.2 | J8.1 47.5,56.39 v48.01,56.9 | J8.1 47.5,58.43 LED3.C 44.72,58.69 v44.7,58.67 42.18,58.67 LED4.C | J8.1 v49.28,53.34 R11.2 | C11.2 52.28,29.63 | 52.28,29.63 v52.32,29.59 | 52.28,29.63 C12.2 54.01,29.63 54.74,30.35 C26.2 | C18.2 53.43,68.7 53.21,68.48 53.21,68.45 v52.83,68.07 52.83,66.64 R13.2 | C13.2 50.63,6.64 v50.16,7.11 49.15,8.13 C14.2 | C20.2 14.06,71.25 14.35,71.25 14.48,71.12 U1.2 | C25.2 43.85,30.73 v43.43,30.73 | C7.2 v41.66,38.86 | C27.2 57.24,43.27 v57.15,43.18 | C28.2 46.57,48.48 v46.61,48.51 | C21.2 29.97,46.74 | 29.97,46.74 28.45,45.21 21.94,45.21 IC5.4 | C4.1 25.11,63.03 26.16,61.98 v26.92,61.98 | C2.2 29.08,62.87 28.19,61.98 v26.92,61.98 | C3.2 v26.92,61.98 | LED2.C 6.24,61.35 v6.22,61.34 LED1.C | J17.3 62.19,48.98 R2.1
  Bottom 0.508: R22.1 19.6,46.99 IC5.4 | C32.1 50.89,59.27 51.44,59.82 U2.1 U2.2 U2.3 U2.4
  pour Top: 0.13,76.2 0.13,70.87 16.38,70.87 16.38,71.25 31.62,71.25 31.62,76.2
  pour Bottom: 0,76.2 100.58,76.2 100.58,0 0,0
GND-ISO  (via drill 0.35)
  Top 0.508: v114.43,30.48 114.47,30.52 C17.1 114.47,33.44 114.94,33.91 IC4.5 114.94,37.08 112.39,39.62 IC4.14 112.39,41.78 110.24,43.94 v108.46,43.94 | J7.3 115.7,24.77 R4.1 | v110.24,51.05 LED6.C 104.79,52.46 J5.1 | v108.46,43.94 107.7,43.94 106.93,43.18 C29.2 | C33.2 v108.46,43.94 | C15.2 C16.2 108.2,32.89 107.82,32.51 v107.44,32.51 106.93,32.51 106.68,32.77 C15.2
  pour Bottom: 102.87,76.2 127,76.2 127,38.61 102.87,38.61
  pour Bottom: 102.87,37.85 127,37.85 127,0 102.87,0
HSE_IN
  Top 0.254: R29.2 42.16,41.91 42.95,41.12 IC1.5
HSE_OUT
  Top 0.254: IC1.6 38.72,40.62 X1.1 C30.2
HX_CLK
  Top 0.508: R32.1 116.2,43.4 IC4.11
HX_LED
  Top 0.508: J16.1 R26.1
HX_SDA
  Top 0.254: IC4.12 114.94,41.78 113.28,43.43 112.14,43.43 111.51,44.07 111.51,49.44 R33.1
HXCLK
  Top 0.508: J8.3 43.69,53.85 R30.1
HXCLK_P  (via drill 0.35)
  Top 0.254: IC1.62 46.78,43.99 v46.74,43.94 | v44.96,48.51 43.69,49.78 R30.2
  Top 0.508: R30.2 39.2,49.95 U$2.1
  Bottom 0.254: v46.74,43.94 45.72,43.94 44.96,44.7 v44.96,48.51
HXDATA
  Top 0.508: J8.2 46.48,53.59 R31.1
HXDATA_P
  Top 0.254: R31.2 47.75,48.68 47.75,46.48 47.28,46.01 IC1.61 47.28,43.6 47.09,43.41 46,43.41 42.42,46.99 U$3.1
IM0
  Bottom 0.508: R5.2 SV2.3
IM1
  Top 0.508: R6.2 SV2.4
IM2
  Top 0.508: R38.2 SV2.5
IM3
  Top 0.508: R39.2 SV2.6
LITE  (via drill 0.35)
  Top 0.254: v61.98,38.61 61.96,38.62 IC1.39 55.26,38.61 v47.24,38.61 | SV1.13 26.67,23.37 36.58,33.27 v41.91,33.27
  Top 0.508: SV2.11 96.52,28.45 U$1.1
  Bottom 0.254: v61.98,38.61 72.14,28.45 SV2.11 | v47.24,38.61 v41.91,33.27
  Bottom 0.508: R14.1 SV1.13
MEM_SCL  (via drill 0.35)
  Top 0.203: IC1.58 48.78,43.93 v49.02,43.69
  Bottom 0.203: v49.02,43.69 49.28,43.69 53.98,48.39 53.98,55.63 U2.6
  Bottom 0.508: R36.2 53.98,54.9 53.98,55.63 | U2.6 53.98,49.57 54,49.55 54,48.66 v49.02,43.69
MEM_SDA  (via drill 0.35)
  Top 0.203: IC1.59 48.28,43.96 v48.26,43.94
  Top 0.254: v53.34,49.28 54.36,50.29 v55.12,50.29
  Bottom 0.508: U2.5 55.24,50.42 v55.12,50.29 | R37.2 52.41,50.2 v53.34,49.28 53.34,49.02 v48.26,43.94
N$1
  Top 0.508: IC3.4 21.64,58.67 C9.2
N$2
  Top 0.508: R15.1 4.83,65.11 LED1.A
N$3
  Top 0.508: IC2.4 22.41,63.82 22.48,63.75 C4.2
N$4
  Top 0.508: R16.1 11.52,58.46 16.76,53.21 26.96,53.21 IC5.7
N$5
  Top 0.508: R16.2 7.76,63.25 LED2.A
N$6
  Top 0.508: R15.2 12.32,65.15 12.7,64.77 12.7,58.42 16.51,54.61 IC5.1
N$7
  Top 0.508: U1.5 17.84,72.07 18.58,72.81 R17.1
N$8
  Bottom 0.508: R44.1 J13.2
N$9
  Top 0.508: R25.1 LED4.A
N$10  (via drill 0.35)
  Top 0.508: v122.26,48.51 10HZ.2
  Bottom 0.508: R27.2 123.02,48.51 v122.26,48.51
N$11
  Top 0.254: 116.2,32.3 C17.2
  Top 0.508: IC4.6 116.2,32.3
N$12  (via drill 0.35)
  Top 0.508: IC4.15 111.12,39.5 v111.38,39.24 | v117.09,43.94 117.09,44.7 117.86,45.47 80HZ.1 10HZ.1
  Bottom 0.508: v111.38,39.24 113.92,39.24 117.09,42.42 v117.09,43.94
N$13
  Top 0.508: R24.1 LED3.A
N$14
  Top 0.508: R26.2 110.19,54.27 LED6.A
N$15
  Top 0.508: IC3.5 21.64,60.71 R35.2
N$16
  Top 0.508: 80HZ.2 R28.2
N$17
  Top 0.254: NRST.4 NRST.3
  Top 0.508: R13.1 56.09,68.2 NRST.3
N$18
  Top 0.254: R29.1 37.47,41.91 X1.2 C31.2
N$19
  Top 0.508: IC2.5 22.16,65.72 22.61,65.28 R34.2
N$20
  Top 0.508: R45.1 J13.3
N$21
  Top 0.508: R46.1 J13.4
NC_MISO
  Top 0.508: R42.1 J6.4
NRST  (via drill 0.35)
  Top 0.254: NRST.1 NRST.2 | IC1.7 44.56,40.12 44.96,40.51 v44.96,42.29 | v51.69,68.07 51.69,69.56 C18.1
  Top 0.508: NRST.1 56.39,72.52 U$5.1 | U$5.1 48.98,72.52 R12.2 | C18.1 51.69,69.64 U$5.1
  Bottom 0.254: v51.69,68.07 48.9,65.28 48.9,54.48 44.43,50.02 44.43,44.6 44.96,44.07 v44.96,42.29
OLED_MOSI  (via drill 0.35)
  Top 0.254: IC1.53 51.31,45.08 v51.31,43.69
  Bottom 0.254: v51.31,43.69 51.82,43.69 54.61,46.48 54.61,48.77 55.37,49.53 62.74,49.53 66.8,53.59 66.8,61.98 70.52,65.7 R44.2
OLED_NSS
  Top 0.254: IC1.52 51.78,46.19 56.13,50.55 56.13,51.82 59.18,54.86 65.02,54.86 67.56,57.4 67.56,60.45 70.87,63.75 72.39,63.75 73.66,65.02 R45.2
OLED_SCK
  Top 0.254: IC1.51 52.28,46.06 56.64,50.42 56.64,51.56 59.44,54.36 65.66,54.36 68.33,57.02 68.33,59.69 71.37,62.74 74.42,62.74 76.2,64.52 R46.2
PA9
  Top 0.254: IC1.42 59.42,40.12 74.55,55.24 76.58,55.24 77.47,56.13 J1.4
PA10
  Top 0.254: IC1.43 59.03,40.62 74.93,56.52 J1.3
PA11
  Top 0.254: IC1.44 58.77,41.12 72.39,54.74 J1.2
PA12
  Top 0.254: IC1.45 58.38,41.62 69.85,53.09 J1.1
PB3
  Top 0.254: J2.3 61.72,55.37 58.17,55.37 52.2,49.4 52.2,48.1 50.28,46.19 IC1.55
PB4
  Top 0.254: IC1.56 49.78,46.22 51.82,48.26 51.82,49.78 57.91,55.88 59.69,55.88 J2.2
PB5
  Top 0.254: IC1.57 49.28,46.45 49.66,46.83 49.66,46.86 51.31,48.51 51.31,50.04 J2.1
PC0  (via drill 0.35)
  Top 0.254: IC1.8 44.7,39.62 45.21,39.62 v45.47,39.37
  Bottom 0.254: v45.47,39.37 45.47,38.86 44.96,38.35 44.96,37.08 42.04,34.16 41.27,34.16 27.43,20.32 J3.5
PC1  (via drill 0.35)
  Top 0.254: IC1.9 44.76,39.12 45.59,38.29 45.59,35.1 45.89,34.8 v45.97,34.8 | v44.7,33.27 24.89,13.46 J3.4
  Bottom 0.254: v45.97,34.8 45.72,34.8 44.7,33.78 v44.7,33.27
PC2
  Top 0.254: IC1.10 44.72,38.62 45.21,38.13 45.21,34.8 22.35,11.94 J3.3
PC3
  Top 0.254: IC1.11 44.68,38.12 44.83,37.97 44.83,35.56 44.83,35.41 44.83,35.05 19.81,10.03 J3.2
SD_CS
  Top 0.254: IC1.40 61.47,39.12 73.66,51.31 SV2.2
  Top 0.508: R9.1 87.63,52.58 SV2.2
SD_DET
  Top 0.254: IC1.41 61.09,39.62 75.31,53.85 SV2.1
SS_CS
  Top 0.508: R40.1 J6.2
SS_MOSI
  Top 0.508: R43.1 J6.5
SS_SCK
  Top 0.508: R41.1 J6.3
STAT  (via drill 0.35)
  Top 0.508: U1.1 14.51,72.77 v13.84,72.77
  Bottom 0.254: IC5.3 20.03,49.4 17.14,49.4 16.51,50.04 16.51,54.61 13.84,57.28 v13.84,72.77 | R19.2 20.03,74.04 R18.1
  Bottom 0.508: IC5.6 IC5.3 | v13.84,72.77 14.44,72.77 R19.2
SWCLK
  Top 0.254: J17.1 54.86,47.75 53.28,46.17 IC1.49
  Top 0.508: R2.2 55.88,48.48 J17.1
SWDIO
  Top 0.254: IC1.46 58.12,42.12 58.59,42.58 R1.1
  Top 0.508: J17.2 58.59,47.59 R1.1
TFT_CS  (via drill 0.35)
  Top 0.254: SV2.14 91.06,18.67 91.06,14.86 90.68,14.48 78.99,14.48 57.85,35.62 IC1.33 56.34,34.54 v56.39,34.54
  Top 0.508: SPI.4 SV2.14 R10.1
  Bottom 0.254: SV1.18 14.22,10.67 18.16,6.73 25.53,6.73 26.16,6.1 26.16,4.57 26.92,3.81 28.19,3.81 28.7,4.32 28.7,13.72 33.27,18.29 40.64,18.29 43.94,21.59 50.29,21.59 56.39,27.69 v56.39,34.54
TFT_DC  (via drill 0.35)
  Top 0.254: SV2.13 82.8,23.37 70.48,35.69 61.85,35.69 59.92,37.62 IC1.37 47.78,37.62 v46.99,36.83 | v40.39,31.75 37.08,31.75 18.54,13.21 SV1.17
  Top 0.508: SV2.13 SPI.5
  Bottom 0.254: v46.99,36.83 41.91,31.75 v40.39,31.75
TFT_MISO
  Top 0.254: IC1.35 58.38,36.62 79.25,15.75 SV2.16
  Bottom 0.508: SV2.16 SPI.2
TFT_MOSI
  Top 0.254: SV2.15 77.98,18.29 59.15,37.12 IC1.36
  Bottom 0.508: SV2.15 SPI.3
TFT_NRST  (via drill 0.35)
  Top 0.254: SV2.12 77.72,37.08 62.36,37.08 61.32,38.12 IC1.38 55.25,38.1 47.49,38.1 v47.11,37.73 | v41.16,32.5 36.81,32.5 25.15,20.83 SV1.14
  Bottom 0.254: v47.11,37.73 41.9,32.51 41.18,32.51 v41.16,32.5
TFT_SCK
  Top 0.254: SV2.17 76.33,13.21 54.1,35.43 54.1,35.81 54.41,36.12 IC1.34
  Top 0.508: SV2.17 SPI.1
V_BASE
  Top 0.508: Q1.2 109.47,28.19 111.12,29.84 IC4.2
V_BATT
  Top 0.508: 15.21,67.31 U1.3 13.91,70.17 13.72,69.98 C20.1 12.03,68.2 C23.1 8,68.2 PWR.2 | 15.21,67.31 15.21,66.79 C5.1 19.04,65.75 IC2.1 | C6.1 C10.1 15.21,61.15 | IC3.1 16.23,60.64 C6.1 | C6.1 15.81,60.54 15.21,61.15 | 15.21,67.31 15.28,67.24 C1.1 15.28,61.21 15.21,61.15
  pour Top: 16.26,70.48 5.46,70.48 5.46,67.31 16.26,67.31
V_FB
  Top 0.508: R4.2 R3.1 113.28,33.27 113.67,33.66 IC4.4
V_HI
  Bottom 0.508: R22.2 R21.1 18.07,52.07 IC5.2
V_LO
  Bottom 0.508: R20.1 R23.2 31.49,50.38 IC5.5
VCAP1
  Top 0.254: C11.1 52.28,32.3 IC1.30 52.28,32.39 C12.1
VDD
  Top 0.508: C29.1 C33.1 | Q1.1 109.86,31.11 IC4.1 C16.1 C15.1 104.81,35.39 U$8.1
  pour Top: 102.87,76.2 127,76.2 127,0 102.87,0
VDDA  (via drill 0.35)
  Top 0.254: IC1.13 42.8,37.12 C7.1 40.89,36.74 v40.89,39.37 | v40.89,44.7 34.04,51.56 34.04,54.86 28.49,60.41 C8.1
  Top 0.508: R35.1 26.63,60.71 C8.1 31.96,60.41 U$6.1 40.39,68.83 J15.2
  Bottom 0.254: v40.89,39.37 v40.89,44.7
VIN
  Top 0.813: J12.1 4.32,72.01 PWR.1
X+  (via drill 0.35)
  Top 0.254: IC1.27 50.78,34.78 v51.82,35.81
  Top 0.508: SV2.9 J11.2
  Bottom 0.254: v51.82,35.81 55.88,39.88 77.47,39.88 83.82,33.53 SV2.9
X-  (via drill 0.35)
  Top 0.254: IC1.24 49.28,34.8 v49.4,34.92
  Top 0.508: SV2.7 J11.4
  Bottom 0.254: v49.4,34.92 55.63,41.15 78.99,41.15 81.53,38.61 SV2.7
Y+  (via drill 0.35)
  Top 0.254: IC1.26 50.29,33.62 v50.29,32.51
  Top 0.508: SV2.10 J11.1
  Bottom 0.254: v50.29,32.51 50.8,32.51 57.53,39.24 72.26,39.24 80.52,30.99 SV2.10
Y-  (via drill 0.35)
  Top 0.254: IC1.25 49.78,34.54 v50.8,35.56
  Top 0.508: SV2.8 J11.3
  Bottom 0.254: v50.8,35.56 55.63,40.39 78.49,40.39 82.8,36.07 SV2.8

### Text on the board
tNames: Digital Side | 3.3V | MOSI | ~CS | SCK | GND | VDDA | 3.3V | OLED | TP4 | 3.3V | VDDA | PB5 | PB4 | PB3 | PA12 | PA11 | PA10 | PA9 | Yellow = Charging / Green = Charged | HX711 | 3.3V | NC_D7 | 3.3V | CLK | DT | GND | SD_DET | OP | TP3 | GND | NC_D6 | SD_NSS | SWCLK | SWDIO | GND | AMP | TP2 | DATA | 3.3V | NC_D5 | IM0 | CLK | NC_D4 | 16MHz | IM1 | VDD | RATE | NC_D3 | IM2 | IM3 | NC_D2 | NC_D1 | X- | TP0 | HX711 | TP1 | Y- | NC_D0 | 3V3 | RT | NC_Y- | X+ | NC_X- | Y+ | TP1 | NC_Y+ | LITE | PNP | NC_X+ | SPI TFT Header | ~RST | TO LOAD CELL | LITE | D/C | GND | ~RST | ~CS | E+ | E- | A- | A+ | NC_RD | MOSI | NC_WR | MISO | GND | D/C | SCK | ~LCD_CS | 3Vo | 3.3V | +3.3V | BUTTONS / ADC | SS DISPLAY | GND | GND | CS | MISO | 3V3 | Analog Side | GND | PC3 | PC2 | PC1 | PC0 | 3V3 | GND | SCK | MOSI
bNames: Team 10: Smart Ingredient Scale / Jeremy Tang - Team Leader / Gautam Fotedar - Systems Engineer / Ben Schwartz - Software Engineer / Ryan Montsma - Hardware Engineer / / Board Revision 1.0
Document: Main Board | Load Cell | Digital Side | Analog Side